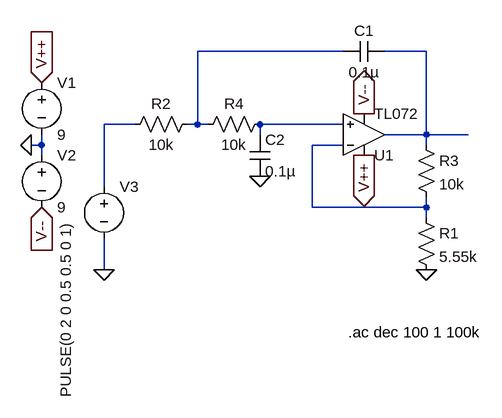
[diagram p0: schematic LowPassSecondOrderSK.asc]
LowPassSecondOrderSK.asc, the LTspice schematic file:
Version 4
SHEET 1 880 684
WIRE 608 144 384 144
WIRE 736 144 672 144
WIRE 288 256 240 256
WIRE 384 256 384 144
WIRE 384 256 368 256
WIRE 400 256 384 256
WIRE 608 256 480 256
WIRE 480 272 480 256
WIRE 736 272 736 144
WIRE 736 272 672 272
WIRE 800 272 736 272
WIRE 144 288 144 272
WIRE 144 288 128 288
WIRE 608 288 560 288
WIRE 736 288 736 272
WIRE 144 304 144 288
WIRE 240 352 240 256
WIRE 560 384 560 288
WIRE 736 384 736 368
WIRE 736 384 560 384
WIRE 736 400 736 384
WIRE 240 480 240 432
FLAG 128 288 0
FLAG 144 192 V++
IOPIN 144 192 In
FLAG 144 384 V--
IOPIN 144 384 In
FLAG 240 480 0
FLAG 640 240 V--
IOPIN 640 240 Out
FLAG 640 304 V++
IOPIN 640 304 Out
FLAG 736 480 0
FLAG 480 336 0
SYMBOL Voltage 144 176 R0
SYMATTR InstName V1
SYMATTR Value 9
SYMBOL Voltage 144 288 R0
SYMATTR InstName V2
SYMATTR Value 9
SYMBOL Voltage 240 336 R0
WINDOW 3 -59 70 VRight 2
SYMATTR Value PULSE(0 2 0 0.5 0.5 0 1)
SYMATTR InstName V3
SYMATTR Value2 AC 1
SYMBOL OpAmps/TL072 640 336 M180
SYMATTR InstName U1
SYMBOL Res 384 240 R90
WINDOW 0 0 56 VBottom 2
WINDOW 3 32 56 VTop 2
SYMATTR InstName R2
SYMATTR Value 10k
SYMBOL Cap 672 128 R90
WINDOW 0 0 32 VBottom 2
WINDOW 3 32 32 VTop 2
SYMATTR InstName C1
SYMATTR Value 0.1µ
SYMBOL Res 720 272 R0
SYMATTR InstName R3
SYMATTR Value 10k
SYMBOL Res 496 240 R90
WINDOW 0 0 56 VBottom 2
WINDOW 3 32 56 VTop 2
SYMATTR InstName R4
SYMATTR Value 10k
SYMBOL Cap 464 272 R0
SYMATTR InstName C2
SYMATTR Value 0.1µ
SYMBOL Res 720 384 R0
SYMATTR InstName R1
SYMATTR Value 5.55k
TEXT 616 576 Left 2 !.ac dec 100 1 100k

The netlist it stands for:
* LowPassSecondOrderSK.asc
V1 V++ 0 9
V2 0 V-- 9
V3 N003 0 PULSE(0 2 0 0.5 0.5 0 1) AC 1
XU1 N004 N005 V++ V-- N002 TL072  ; pins In+ In- V+ V- OUT
R2 N001 N003 10k
C1 N002 N001 0.1µ
R3 N002 N005 10k
R4 N004 N001 10k
C2 N004 0 0.1µ
R1 N005 0 5.55k
.ac dec 100 1 100k
.backanno
.end